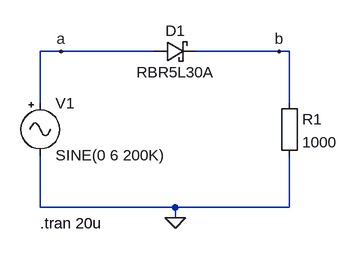
[diagram p0: schematic RHV-FR.asc]
RHV-FR.asc, the LTspice schematic file:
Version 4
SHEET 1 880 680
WIRE -256 112 -288 112
WIRE -112 112 -256 112
WIRE 80 112 -48 112
WIRE 96 112 80 112
WIRE -288 192 -288 112
WIRE 96 192 96 112
WIRE -288 352 -288 272
WIRE -80 352 -288 352
WIRE 96 352 96 272
WIRE 96 352 -80 352
WIRE -80 368 -80 352
FLAG -80 368 0
FLAG -256 112 a
FLAG 80 112 b
SYMBOL schottky -112 128 R270
WINDOW 0 32 32 VTop 2
WINDOW 3 0 32 VBottom 2
SYMATTR InstName D1
SYMATTR Value RBR5L30A
SYMATTR Description Diode
SYMATTR Type diode
SYMBOL Misc\\EuropeanResistor 80 176 R0
SYMATTR InstName R1
SYMATTR Value 1000
SYMBOL Misc\\signal -288 176 R0
WINDOW 123 0 0 Left 2
WINDOW 39 0 0 Left 2
SYMATTR InstName V1
SYMATTR Value SINE(0 6 200K)
TEXT -288 376 Left 2 !.tran 20u

The netlist it stands for:
* RHV-FR.asc
D1 a b RBR5L30A
R1 b 0 1000
V1 a 0 SINE(0 6 200K)
.model D D
.lib standard.dio
.tran 20u
.backanno
.end